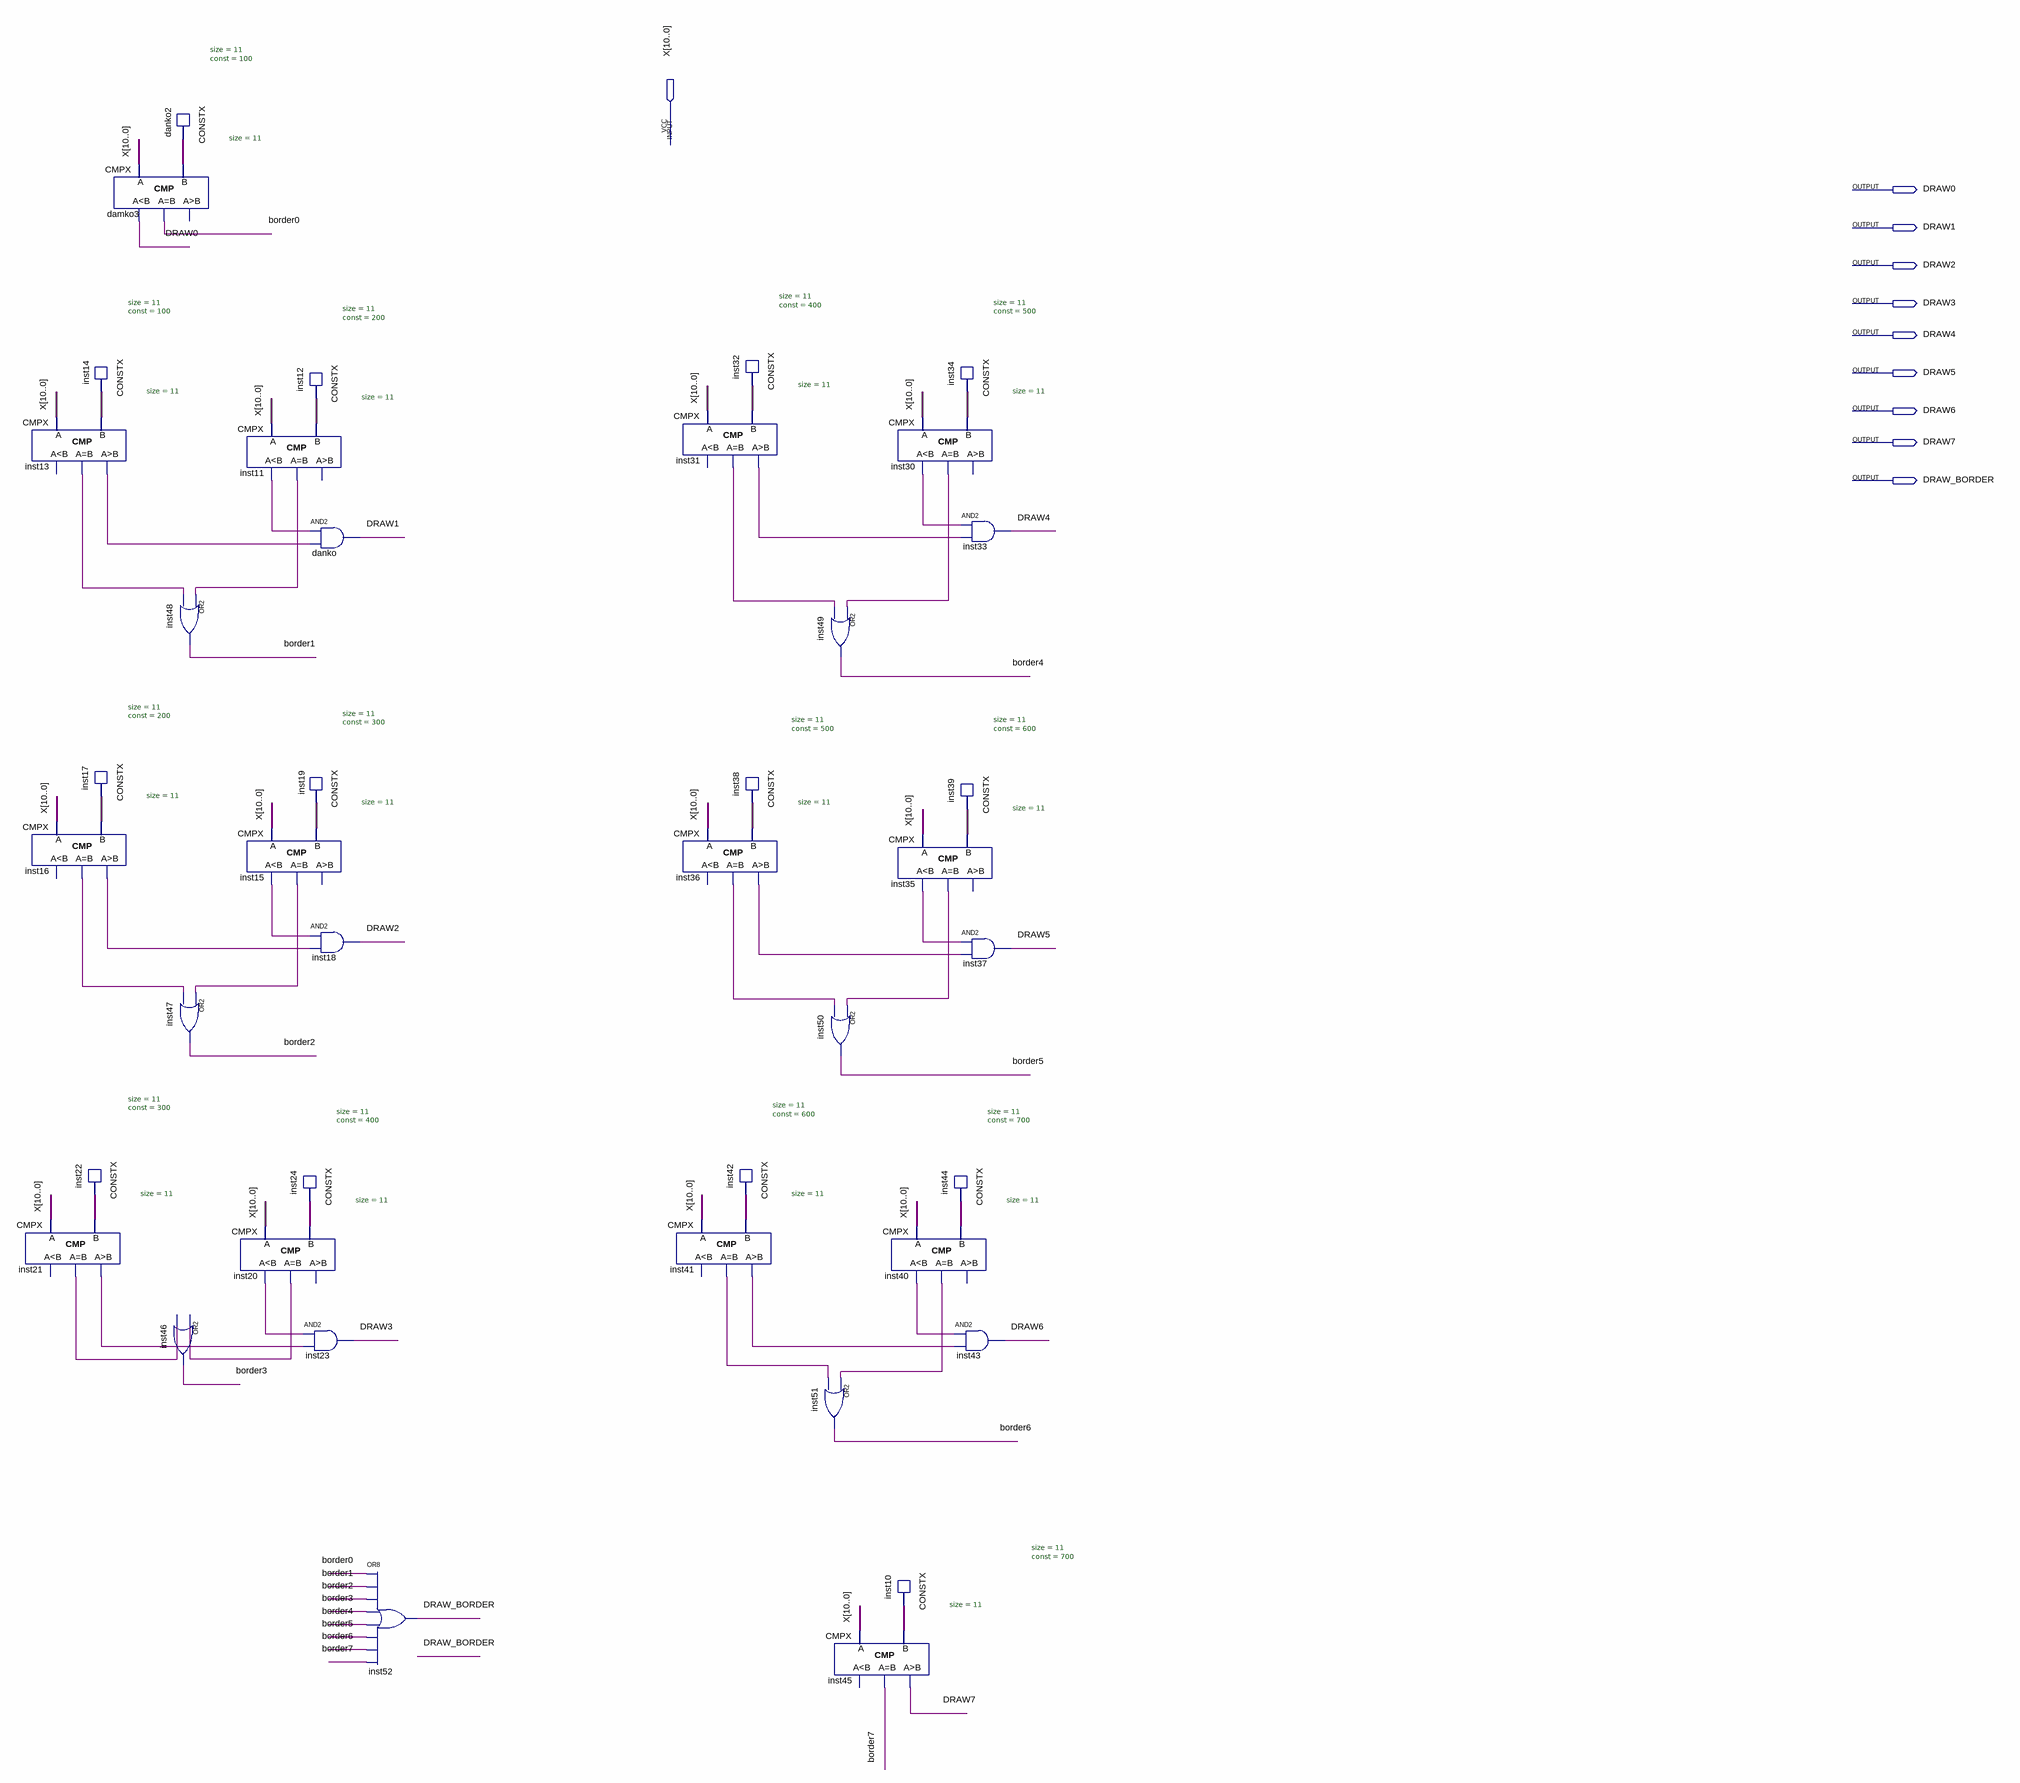
[diagram p0: schematic sheet]
// Quartus schematic backgroundEnables.bdf as structural Verilog: 41 symbols, 10 pins
module backgroundEnables (
  input  [10:0] X,
  output DRAW0,
  output DRAW1,
  output DRAW2,
  output DRAW3,
  output DRAW4,
  output DRAW5,
  output DRAW6,
  output DRAW7,
  output DRAW_BORDER
);

  wire border0, border1, border2, border3, border4, border5, border6, border7, inst11_eq, inst11_ls,
       inst13_eq, inst13_gr, inst15_eq, inst15_ls, inst16_eq, inst16_gr, inst20_eq, inst20_ls, inst21_eq,
       inst21_gr, inst30_eq, inst30_ls, inst31_eq, inst31_gr, inst35_eq, inst35_ls, inst36_eq, inst36_gr,
       inst40_eq, inst40_ls, inst41_eq, inst41_gr;
  wire [10:0] danko2_data, inst10_data, inst12_data, inst14_data, inst17_data, inst19_data, inst22_data,
       inst24_data, inst32_data, inst34_data, inst38_data, inst39_data, inst42_data, inst44_data;

  CMPX #(.size(11)) inst13 (.A(X), .B(inst14_data), .eq(inst13_eq), .gr(inst13_gr));  // open: ls
  CMPX #(.size(11)) inst16 (.A(X), .B(inst17_data), .eq(inst16_eq), .gr(inst16_gr));  // open: ls
  CMPX #(.size(11)) inst21 (.A(X), .B(inst22_data), .eq(inst21_eq), .gr(inst21_gr));  // open: ls
  CONSTX #(.size(11), .\const (300)) inst22 (.data(inst22_data));
  CMPX #(.size(11)) damko3 (.A(X), .B(danko2_data), .ls(DRAW0), .eq(border0));  // open: gr
  CONSTX #(.size(11), .\const (100)) inst14 (.data(inst14_data));
  CONSTX #(.size(11), .\const (200)) inst17 (.data(inst17_data));
  CONSTX #(.size(11), .\const (100)) danko2 (.data(danko2_data));
  or inst48 (border1, inst11_eq, inst13_eq);
  or inst47 (border2, inst15_eq, inst16_eq);
  or inst46 (border3, inst20_eq, inst21_eq);
  CMPX #(.size(11)) inst20 (.A(X), .B(inst24_data), .ls(inst20_ls), .eq(inst20_eq));  // open: gr
  CMPX #(.size(11)) inst11 (.A(X), .B(inst12_data), .ls(inst11_ls), .eq(inst11_eq));  // open: gr
  CMPX #(.size(11)) inst15 (.A(X), .B(inst19_data), .ls(inst15_ls), .eq(inst15_eq));  // open: gr
  CONSTX #(.size(11), .\const (200)) inst12 (.data(inst12_data));
  and danko (DRAW1, inst11_ls, inst13_gr);
  CONSTX #(.size(11), .\const (300)) inst19 (.data(inst19_data));
  and inst18 (DRAW2, inst15_ls, inst16_gr);
  CONSTX #(.size(11), .\const (400)) inst24 (.data(inst24_data));
  and inst23 (DRAW3, inst20_ls, inst21_gr);
  or inst52 (DRAW_BORDER, border0, border1, border2, border3, border4, border5, border6, border7);
  CMPX #(.size(11)) inst31 (.A(X), .B(inst32_data), .eq(inst31_eq), .gr(inst31_gr));  // open: ls
  CMPX #(.size(11)) inst36 (.A(X), .B(inst38_data), .eq(inst36_eq), .gr(inst36_gr));  // open: ls
  CMPX #(.size(11)) inst41 (.A(X), .B(inst42_data), .eq(inst41_eq), .gr(inst41_gr));  // open: ls
  CONSTX #(.size(11), .\const (400)) inst32 (.data(inst32_data));
  CONSTX #(.size(11), .\const (500)) inst38 (.data(inst38_data));
  CONSTX #(.size(11), .\const (600)) inst42 (.data(inst42_data));
  or inst49 (border4, inst30_eq, inst31_eq);
  or inst50 (border5, inst35_eq, inst36_eq);
  or inst51 (border6, inst40_eq, inst41_eq);
  CMPX #(.size(11)) inst45 (.A(X), .B(inst10_data), .eq(border7), .gr(DRAW7));  // open: ls
  CMPX #(.size(11)) inst30 (.A(X), .B(inst34_data), .ls(inst30_ls), .eq(inst30_eq));  // open: gr
  CMPX #(.size(11)) inst35 (.A(X), .B(inst39_data), .ls(inst35_ls), .eq(inst35_eq));  // open: gr
  CMPX #(.size(11)) inst40 (.A(X), .B(inst44_data), .ls(inst40_ls), .eq(inst40_eq));  // open: gr
  CONSTX #(.size(11), .\const (700)) inst10 (.data(inst10_data));
  CONSTX #(.size(11), .\const (500)) inst34 (.data(inst34_data));
  and inst33 (DRAW4, inst30_ls, inst31_gr);
  CONSTX #(.size(11), .\const (600)) inst39 (.data(inst39_data));
  and inst37 (DRAW5, inst35_ls, inst36_gr);
  CONSTX #(.size(11), .\const (700)) inst44 (.data(inst44_data));
  and inst43 (DRAW6, inst40_ls, inst41_gr);
endmodule
